# EAGLE schematic 411_Synth_v2 (EAGLE 7.1.0)
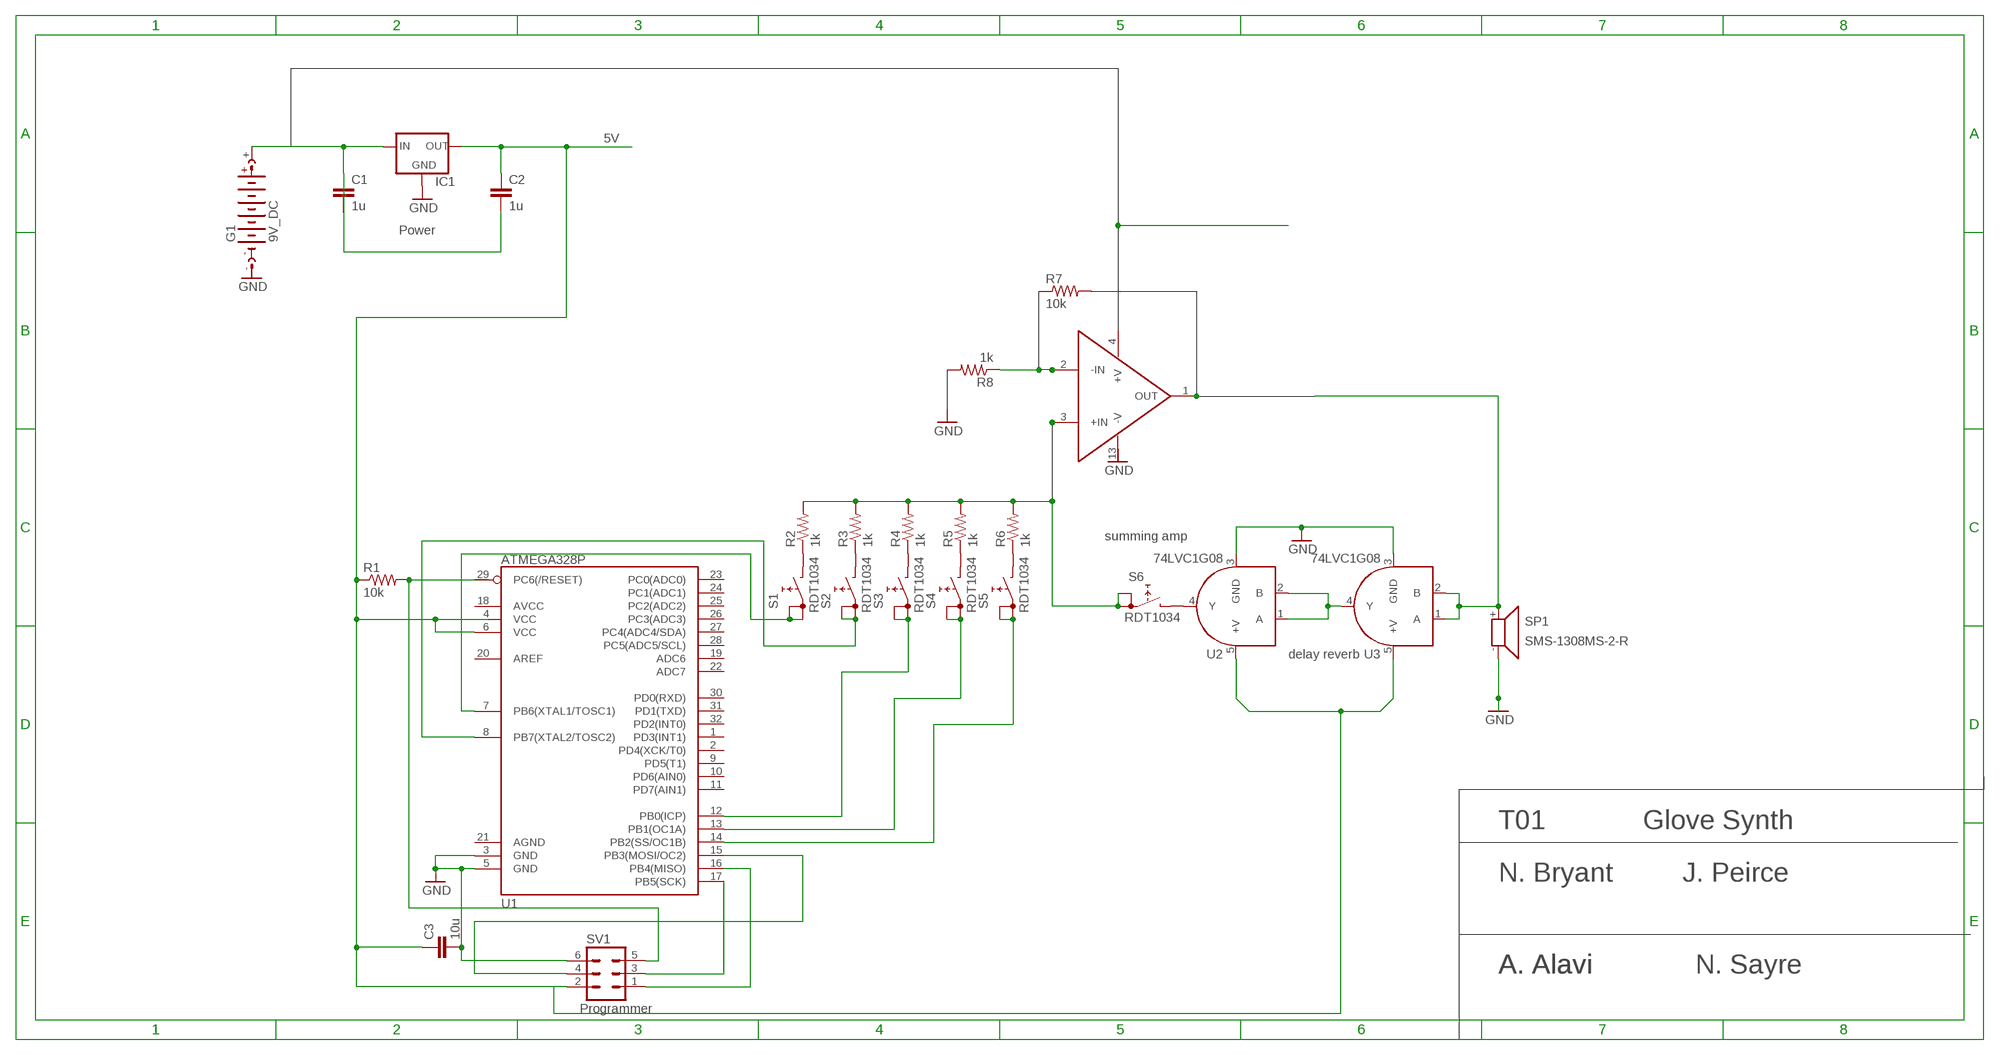
[diagram p0: schematic, sheet 1]

## Parts
C1  1u  CAP0603-CAP  [0603-CAP]
C2  1u  CAP0603-CAP  [0603-CAP]
C3  10u  CAP0603-CAP  [0603-CAP]
G1  9V_DC  AB9V  [AB9V]
IC1  78LXX  [78LXX]
R1  10k  RESISTOR0603  [0603-RES]
R2  1k  RESISTOR0603  [0603-RES]
R3  1k  RESISTOR0603  [0603-RES]
R4  1k  RESISTOR0603  [0603-RES]
R5  1k  RESISTOR0603  [0603-RES]
R6  1k  RESISTOR0603  [0603-RES]
R7  10k  RESISTOR0603  [0603-RES]
R8  1k  RESISTOR0603  [0603-RES]
S1  RDT1034  [RDT1034]
S2  RDT1034  [RDT1034]
S3  RDT1034  [RDT1034]
S4  RDT1034  [RDT1034]
S5  RDT1034  [RDT1034]
S6  RDT1034  [RDT1034]
SP1  SMS-1308MS-2-R  [SMS-1308MS-2-R]
SV1  MA03-2  [MA03-2]
U1  ATMEGA328P  ATMEGA328_SMT  [TQFP32-08]
U2  74LVC1G08  SN74LVC1G08  [SOT23-5]
U3  74LVC1G08  SN74LVC1G08  [SOT23-5]
U$1  LT1014  [SO16L]

## Nets
5V: C2.1 C3.1 IC1.OUT R1.1 SV1.2 U1.6(VCC) U2.5(+V) U3.5(+V)
GND: C3.2 IC1.GND SP1.- SV1.6 U1.3(GND) U2.3(GND) U3.3(GND)
N$1: C1.1 C1.2 C2.2 G1.+ IC1.IN
N$2: SV1.4 U1.15(PB3(MOSI/OC2))
N$3: SV1.1 U1.16(PB4(MISO))
N$4: SV1.3 U1.17(PB5(SCK))
N$5: R1.2 SV1.5 U1.29(PC6(/RESET))
N$6: S1.A S1.A1 U1.7(PB6(XTAL1/TOSC1))
N$7: S2.A S2.A1 U1.8(PB7(XTAL2/TOSC2))
N$8: S3.A S3.A1 U1.12(PB0(ICP))
N$9: S4.A S4.A1 U1.13(PB1(OC1A))
N$10: S5.A S5.A1 U1.14(PB2(SS/OC1B))
N$11: R2.1 S1.B
N$12: R3.1 S2.B
N$13: R4.1 S3.B
N$14: R5.1 S4.B
N$15: R6.1 S5.B
N$16: R8.1
N$17: R6.2
N$18: R5.2
N$19: S6.B U2.4(Y)
N$20: S6.A S6.A1
N$21: U2.1(A) U2.2(B) U3.4(Y)
N$22: SP1.+ U3.1(A) U3.2(B)
N$24: R4.2
N$25: U$1.1(OUT)
N$26: R3.2
N$27: U$1.3(+IN)
N$28: U$1.2(-IN)
Unconnected: G1.- R2.2 R7.1 R7.2 R8.2 U1.1(PD3(INT1)) U1.2(PD4(XCK/T0)) U1.4(VCC) U1.5(GND) U1.9(PD5(T1)) U1.10(PD6(AIN0)) U1.11(PD7(AIN1)) U1.18(AVCC) U1.19(ADC6) U1.20(AREF) U1.21(AGND) U1.22(ADC7) U1.23(PC0(ADC0)) U1.24(PC1(ADC1)) U1.25(PC2(ADC2)) U1.26(PC3(ADC3)) U1.27(PC4(ADC4/SDA)) U1.28(PC5(ADC5/SCL)) U1.30(PD0(RXD)) U1.31(PD1(TXD)) U1.32(PD2(INT0))

## Notes on the sheet
- Power
- summing amp
- delay reverb
- T01 | Glove Synth
- N. Bryant | J. Peirce
- A. Alavi | A. Alavi | N. Sayre
- Programmer

## Power pins joined to a net without a drawn wire
+IN: U$1.5(+IN) U$1.12(+IN) U$1.14(+IN)
+V: U$1.4(+V)
-IN: U$1.6(-IN) U$1.11(-IN) U$1.15(-IN)
-V: U$1.13(-V)
OUT: U$1.7(OUT) U$1.10(OUT) U$1.16(OUT)

## Library data of the parts
C1-C3 = SparkFun-Capacitors:CAP: Capacitor Standard 0603 ceramic capacitor, and 0.1" leaded capacitor.
G1 = battery:AB9V: 9-V BATTERY CLIP
IC1 = v-reg:78LXX: VOLTAGE REGULATOR
R1-R8 = SparkFun-Resistors:RESISTOR: Resistor Basic schematic elements and footprints for 0603, 1206, and PTH resistors.
S1-S6 = switch:RDT1034: PUSH SWITCH www.radiohm.com
SP1 = speaker:SMS-1308MS-2-R: Speaker 13 x 13mm, 8 Ohm, 0.7W Source: pui audio inc. SMS-1308MS-2-R.pdf
SV1 = con-lstb:MA03-2: PIN HEADER; OC_FARNELL: unknown; OC_NEWARK: unknown
U1 = SparkFun-DigitalIC:ATMEGA328_SMT: 32-Pin Atmega328 part Commonly used on Arduino compatible boards Available in QFP and QFN packages TQFP is IC-09069 QFN is non-stock; PROD_ID: IC-09069
U2 U3 = SparkFun-DigitalIC:SN74LVC1G08: Single-gate AND logic; PROD_ID: 10841
U$1 = SparkFun-AnalogIC:LT1014: Precision quad op-amp. I/O range includes negative rail.